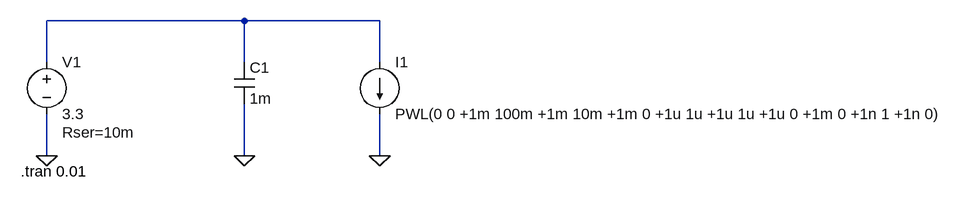
[diagram p0: schematic Power Supplies.asc]
Power Supplies.asc, the LTspice schematic file:
Version 4.1
SHEET 1 1560 680
WIRE 384 48 80 48
WIRE 592 48 384 48
WIRE 80 112 80 48
WIRE 384 112 384 48
WIRE 592 112 592 48
WIRE 80 256 80 192
WIRE 384 256 384 176
WIRE 592 256 592 192
FLAG 80 256 0
FLAG 592 256 0
FLAG 384 256 0
SYMBOL voltage 80 96 R0
WINDOW 123 0 0 Left 0
WINDOW 39 24 124 Left 2
SYMATTR InstName V1
SYMATTR Value 3.3
SYMATTR SpiceLine Rser=10m
SYMBOL current 592 112 R0
WINDOW 123 0 0 Left 0
WINDOW 39 0 0 Left 0
SYMATTR InstName I1
SYMATTR Value PWL(0 0 +1m 100m +1m 10m +1m 0 +1u 1u +1u 1u +1u 0 +1m 0 +1n 1 +1n 0)
SYMBOL cap 368 112 R0
SYMATTR InstName C1
SYMATTR Value 1m
TEXT 40 280 Left 2 !.tran 0.01

The netlist it stands for:
* Power Supplies.asc
V1 N001 0 3.3 Rser=10m
I1 N001 0 PWL(0 0 +1m 100m +1m 10m +1m 0 +1u 1u +1u 1u +1u 0 +1m 0 +1n 1 +1n 0)
C1 N001 0 1m
.tran 0.01
.backanno
.end